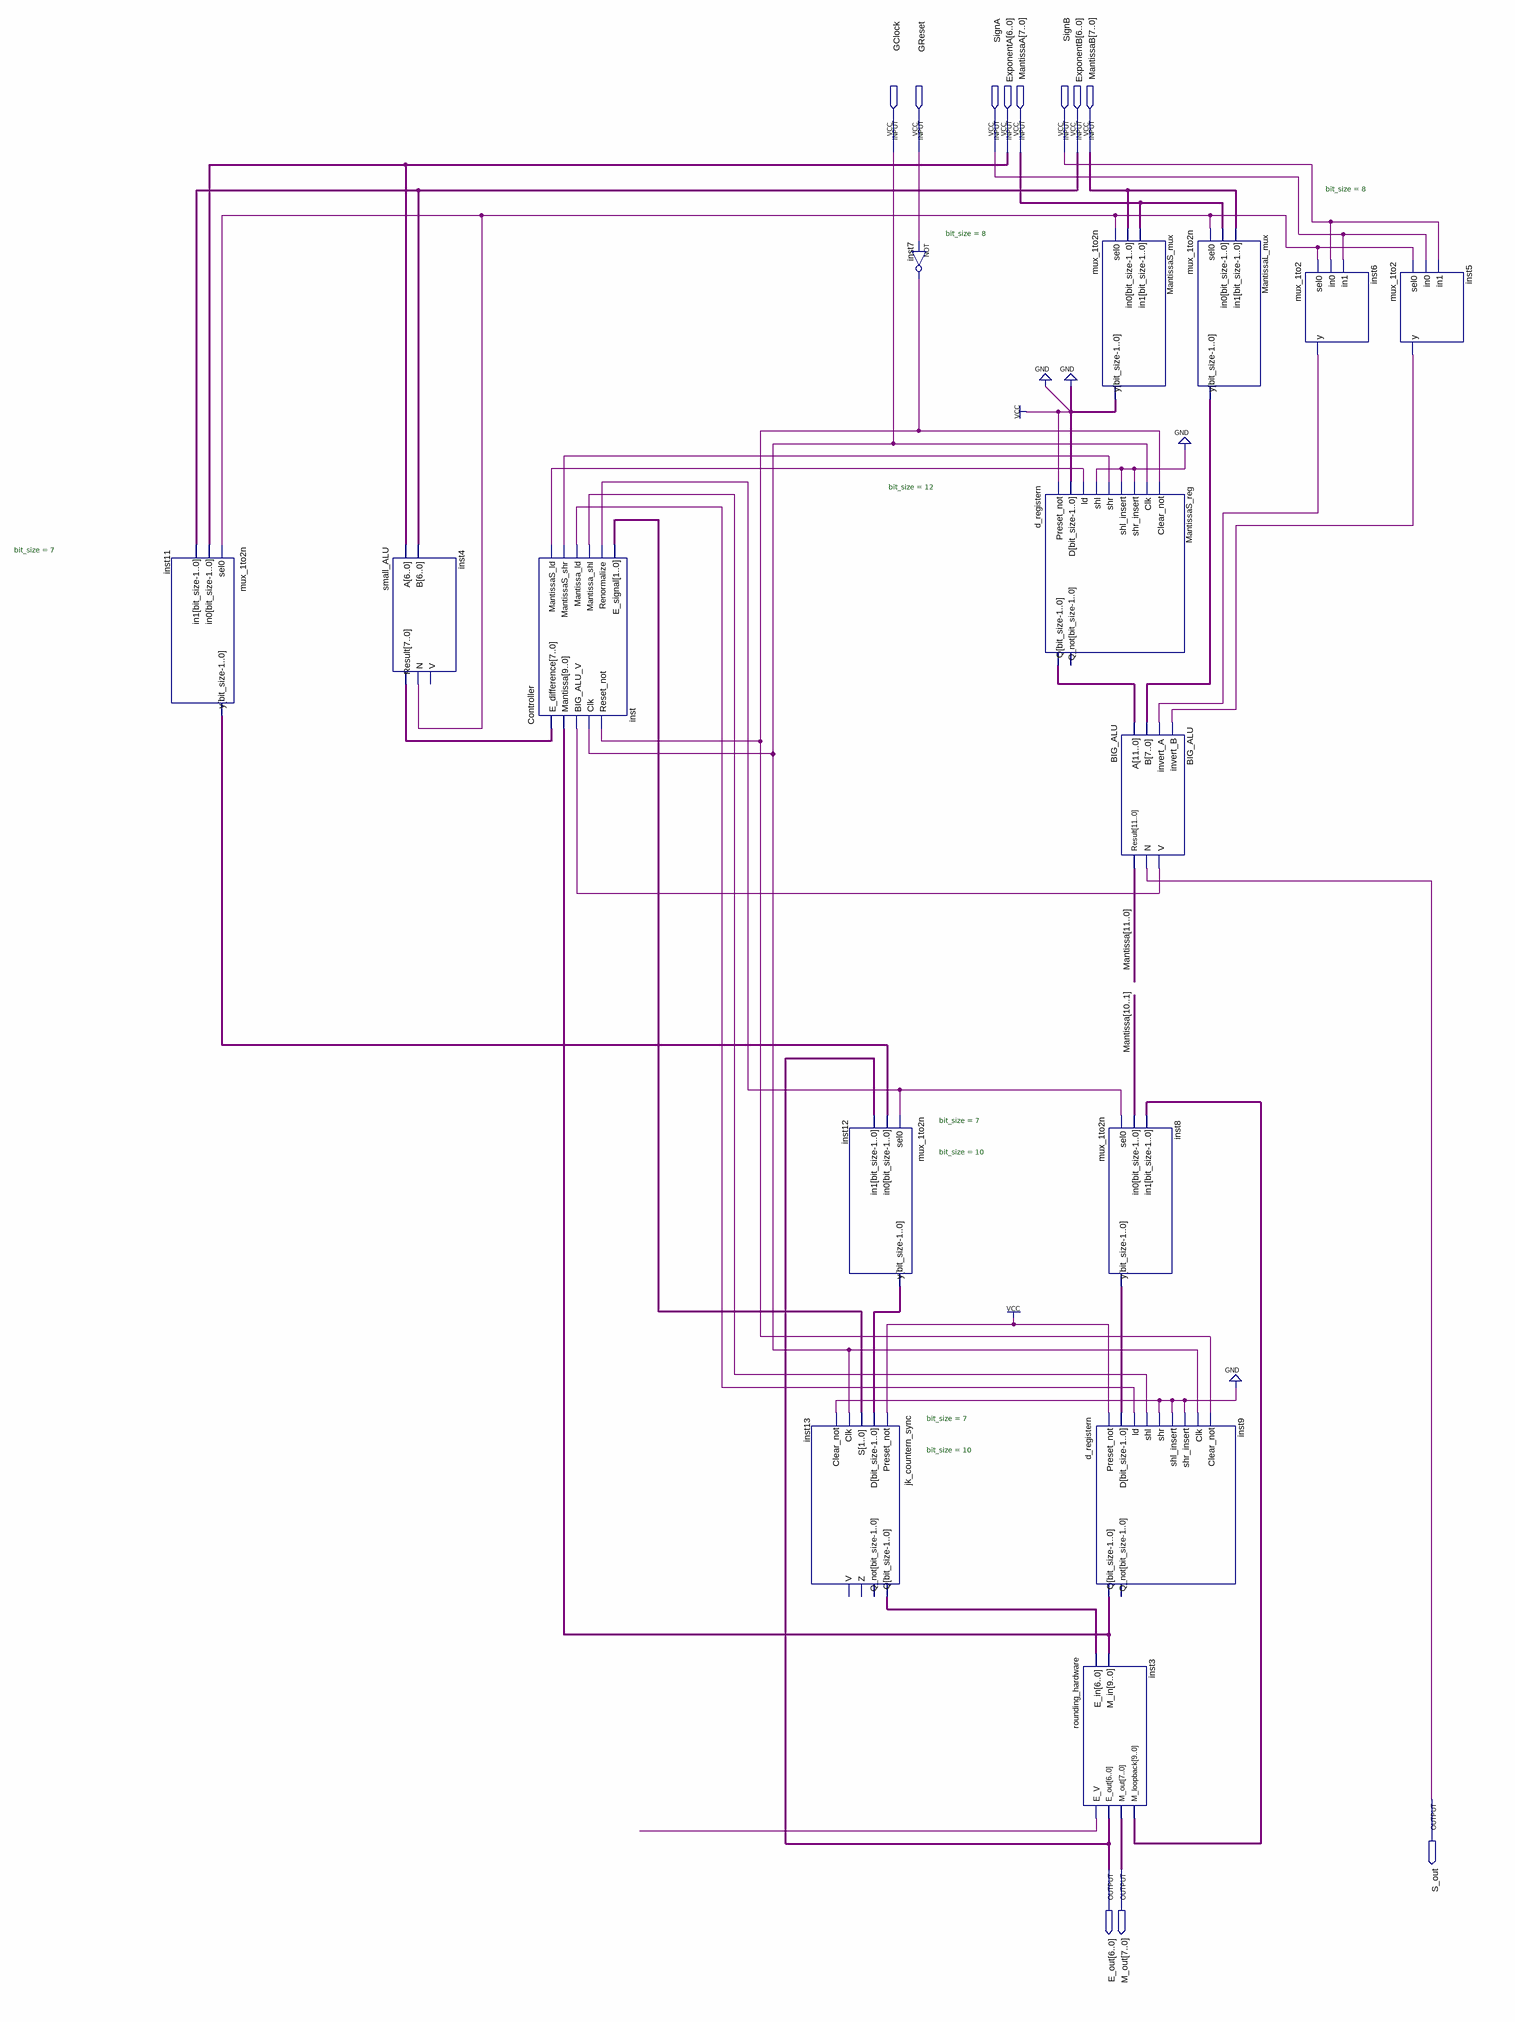
[diagram p0: schematic sheet]
// Quartus schematic lab1-fpMult.bdf as structural Verilog: 15 symbols, 11 pins
module \lab1-fpMult  (
  input  GClock,
  input  GReset,
  input  SignA,
  input  [6:0] ExponentA,
  input  [7:0] MantissaA,
  input  SignB,
  input  [6:0] ExponentB,
  input  [7:0] MantissaB,
  output S_out,
  output [6:0] E_out,
  output [7:0] M_out
);

  wire BIG_ALU_v, inst3_e_v, inst4_n, inst5_y, inst6_y, inst7_out, inst_mantissa_ld, inst_mantissa_shl,
       inst_mantissas_ld, inst_mantissas_shr, inst_renormalize;
  wire [1:0] inst_e_signal;
  wire [6:0] inst11_y, inst12_y, inst13_q;
  wire [7:0] inst4_result, MantissaL_mux_y;
  wire [9:0] inst3_m_loopback, inst8_y, inst9_q;
  wire [9:2] MantissaS;
  wire [11:0] Mantissa, MantissaS_reg_q;

  mux_1to2n #(.bit_size(7)) inst11 (.sel0(inst4_n), .in0(ExponentA), .in1(ExponentB), .y(inst11_y));
  small_ALU inst4 (.A(ExponentA), .B(ExponentB), .Result(inst4_result), .N(inst4_n));  // open: V
  Controller inst (
    .E_difference(inst4_result), .Mantissa(inst9_q), .BIG_ALU_V(BIG_ALU_v), .Clk(GClock),
    .Reset_not(inst7_out), .MantissaS_ld(inst_mantissas_ld), .MantissaS_shr(inst_mantissas_shr),
    .Mantissa_ld(inst_mantissa_ld), .Mantissa_shl(inst_mantissa_shl), .Renormalize(inst_renormalize),
    .E_signal(inst_e_signal));
  jk_countern_sync #(.bit_size(7)) inst13 (
    .Preset_not(1'b1), .D(inst12_y), .S(inst_e_signal), .Clk(GClock), .Clear_not(1'b0), .Q(inst13_q));  // open: Q_not, Z, V
  mux_1to2n #(.bit_size(7)) inst12 (.sel0(inst_renormalize), .in0(inst11_y), .in1(E_out), .y(inst12_y));
  not inst7 (inst7_out, GReset);
  d_registern #(.bit_size(12)) MantissaS_reg (
    .Preset_not(1'b1), .D({2'b01, MantissaS, 2'b00}), .ld(inst_mantissas_ld), .shl(1'b0),
    .shr(inst_mantissas_shr), .shl_insert(1'b0), .shr_insert(1'b0), .Clk(GClock), .Clear_not(inst7_out),
    .Q(MantissaS_reg_q));  // open: Q_not
  mux_1to2n #(.bit_size(8)) MantissaS_mux (.sel0(inst4_n), .in0(MantissaB), .in1(MantissaA), .y(MantissaS));
  mux_1to2n #(.bit_size(10)) inst8 (.sel0(inst_renormalize), .in0(Mantissa[10:1]), .in1(inst3_m_loopback), .y(inst8_y));
  d_registern #(.bit_size(10)) inst9 (
    .Preset_not(1'b1), .D(inst8_y), .ld(inst_mantissa_ld), .shl(inst_mantissa_shl), .shr(1'b0),
    .shl_insert(1'b0), .shr_insert(1'b0), .Clk(GClock), .Clear_not(inst7_out), .Q(inst9_q));  // open: Q_not
  rounding_hardware inst3 (
    .E_in(inst13_q), .M_in(inst9_q), .E_V(inst3_e_v), .E_out(E_out), .M_out(M_out),
    .M_loopback(inst3_m_loopback));
  BIG_ALU BIG_ALU (
    .A(MantissaS_reg_q), .B(MantissaL_mux_y), .invert_A(inst6_y), .invert_B(inst5_y), .Result(Mantissa),
    .N(S_out), .V(BIG_ALU_v));
  mux_1to2n #(.bit_size(8)) MantissaL_mux (.sel0(inst4_n), .in0(MantissaA), .in1(MantissaB), .y(MantissaL_mux_y));
  mux_1to2 inst6 (.sel0(inst4_n), .in0(SignB), .in1(SignA), .y(inst6_y));
  mux_1to2 inst5 (.sel0(inst4_n), .in0(SignA), .in1(SignB), .y(inst5_y));
endmodule
